# EAGLE design psu1 (EAGLE 9.2.0)
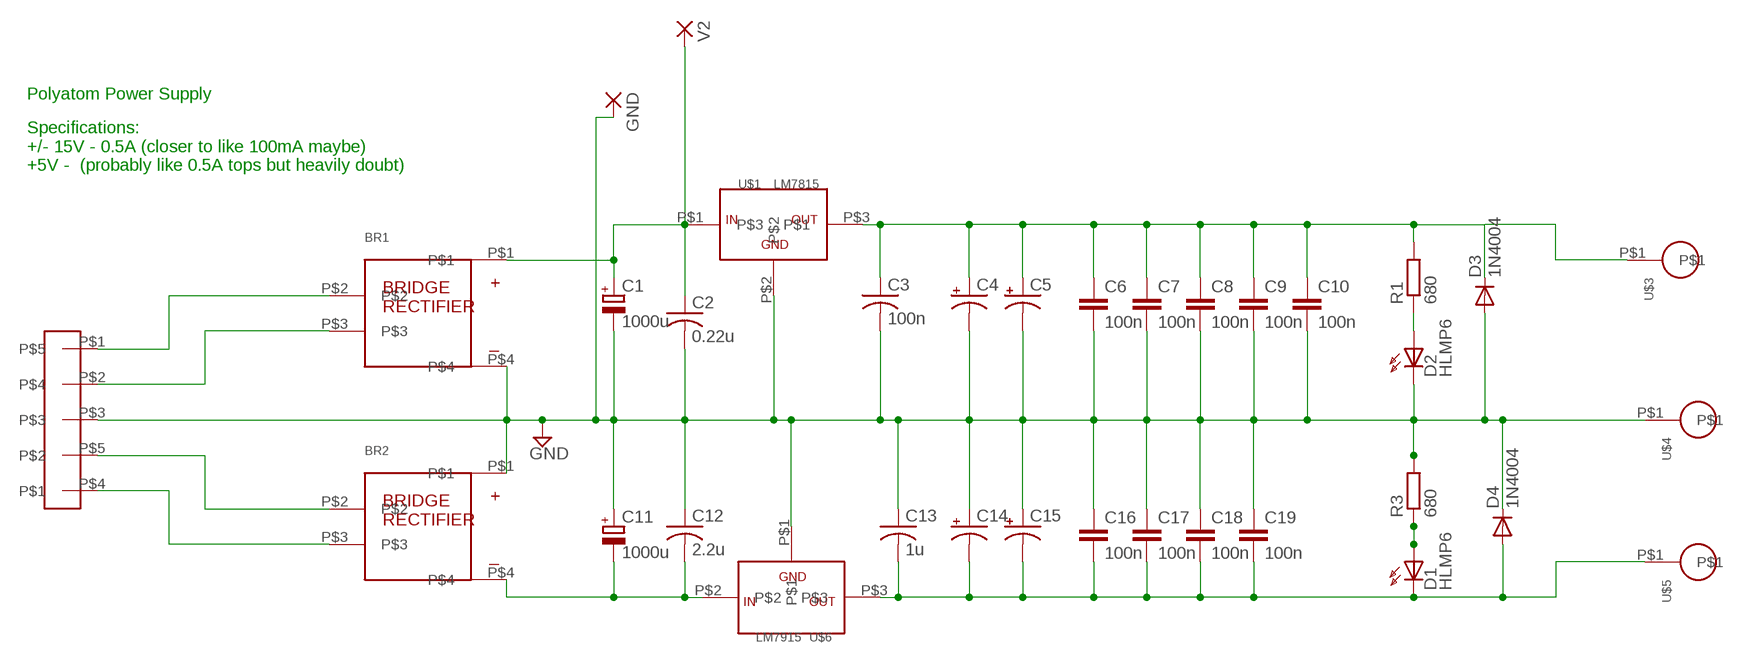
[diagram p0: schematic, sheet 1]

## Parts
BR1  GBU4J  [SIL4]
BR2  GBU4J  [SIL4]
C1  1000u  CPOL-EUE5-13  [E5-13]
C2  0.22u  C-USC1206  [C1206]
C3  100n  C-USC1206  [C1206]
C4  CPOL-USTT2D5  [TT2D5]
C5  CPOL-USTT2D5  [TT2D5]
C6  100n  CC1206  [C1206]
C7  100n  CC1206  [C1206]
C8  100n  CC1206  [C1206]
C9  100n  CC1206  [C1206]
C10  100n  CC1206  [C1206]
C11  1000u  CPOL-EUE5-13  [E5-13]
C12  2.2u  C-USC1206  [C1206]
C13  1u  C-USC1206  [C1206]
C14  CPOL-USTT2D5  [TT2D5]
C15  CPOL-USTT2D5  [TT2D5]
C16  100n  CC1206  [C1206]
C17  100n  CC1206  [C1206]
C18  100n  CC1206  [C1206]
C19  100n  CC1206  [C1206]
D1  HLMP6  [HLMP6]
D2  HLMP6  [HLMP6]
D3  1N4004  [DO41-10]
D4  1N4004  [DO41-10]
GND  3,81/1,1  [3,81/1,1]
R1  680  R0207/10  [0207/10]
R3  680  R0207/10  [0207/10]
U$1  LM7815  [TO-220]
U$3  BANANA  [BANANA]
U$4  BANANA  [BANANA]
U$5  BANANA  [BANANA]
U$6  LM7915  [TO-220]
U$8  TERMINALBLOCK  [TERMINALBLOKC]
V2  3,81/1,1  [3,81/1,1]

## Nets
+15V [POWER]: C3.1 C4.+ C5.+ C6.1 C7.1 C8.1 C9.1 C10.1 D3.C R1.2 U$1.P$3 U$3.P$1
-15V [POWER]: C13.2 C14.- C15.- C16.2 C17.2 C18.2 C19.2 D1.K D4.A U$5.P$1 U$6.P$3
GND [POWER]: BR1.P$4 BR2.P$1 C1.- C2.2 C3.2 C4.- C5.- C6.2 C7.2 C8.2 C9.2 C10.2 C11.+ C12.1 C13.1 C14.+ C15.+ C16.1 C17.1 C18.1 C19.1 D2.K D3.A D4.C GND.1(P) R3.2 U$1.P$2 U$4.P$1 U$6.P$1 U$8.P$3
N$2: D2.A R1.1
N$4: D1.A R3.1
N$8 [POWER]: BR1.P$2 U$8.P$1
N$9 [POWER]: BR1.P$3 U$8.P$2
N$10 [POWER]: BR2.P$2 U$8.P$5
N$11 [POWER]: BR2.P$3 U$8.P$4
NEG [POWER]: BR2.P$4 C11.- C12.2 U$6.P$2
POS: BR1.P$1 C1.+ C2.1 U$1.P$1 V2.1(P)

## Notes on the sheet
- Polyatom Power Supply
- Specifications:
  +/- 15V - 0.5A (closer to like 100mA maybe)
  +5V -  (probably like 0.5A tops but heavily doubt)

## Library data of the parts
BR1 BR2 = STM_Library:GBU4J
C1 C11 = rcl:CPOL-EU: POLARIZED CAPACITOR, European symbol; SPICEPREFIX: C
C2 C3 C12 C13 = rcl:C-US: CAPACITOR, American symbol; SPICEPREFIX: C
C4 C5 C14 C15 = rcl:CPOL-US: POLARIZED CAPACITOR, American symbol; SPICEPREFIX: C
C6-C10 C16-C19 = eagle-ltspice:C: CAPACITOR, European symbol; SPICEMODEL: NONE; SPICEPREFIX: C
D1 D2 = display-hp:HLMP6: LED 2mm horizontal; MF: AGILENT TECHNOLOGIES; MPN: HLMP-6500; OC_FARNELL: 1652490; OC_NEWARK: 40K0088
D3 D4 = diode:1N4004: DIODE general purpose rectifier, 1 A
GND V2 = wirepad:3,81/1,1: THROUGH-HOLE PAD
R1 R3 = eagle-ltspice:R: RESISTOR, European symbol; SPICEMODEL: NONE; SPICEPREFIX: R
U$1 = STM_Library:LM7815
U$3-U$5 = STM_Library:BANANA
U$6 = STM_Library:LM7915
U$8 = STM_Library:TERMINALBLOCK

## Net classes
1 POWER: width 0.762 mm, clearance 0.381 mm

## Board
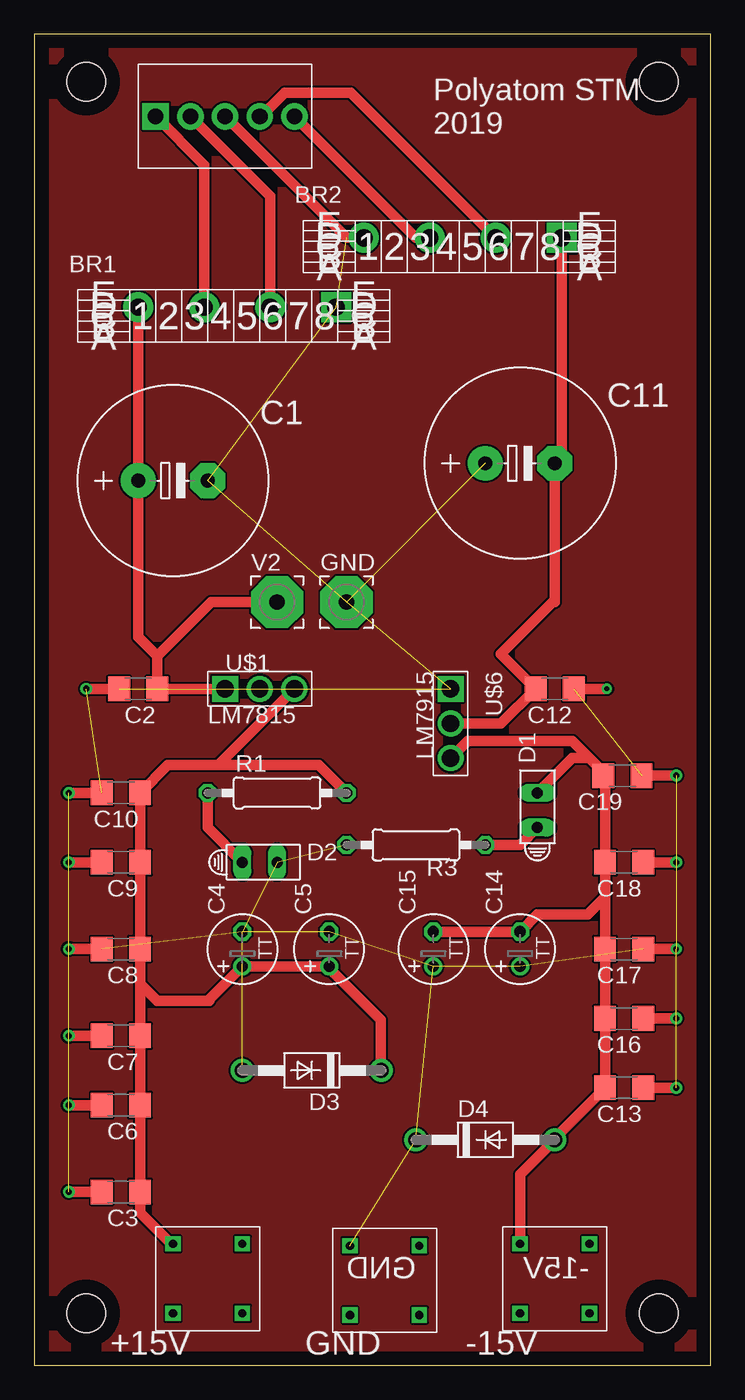
[diagram p1: board, top side]
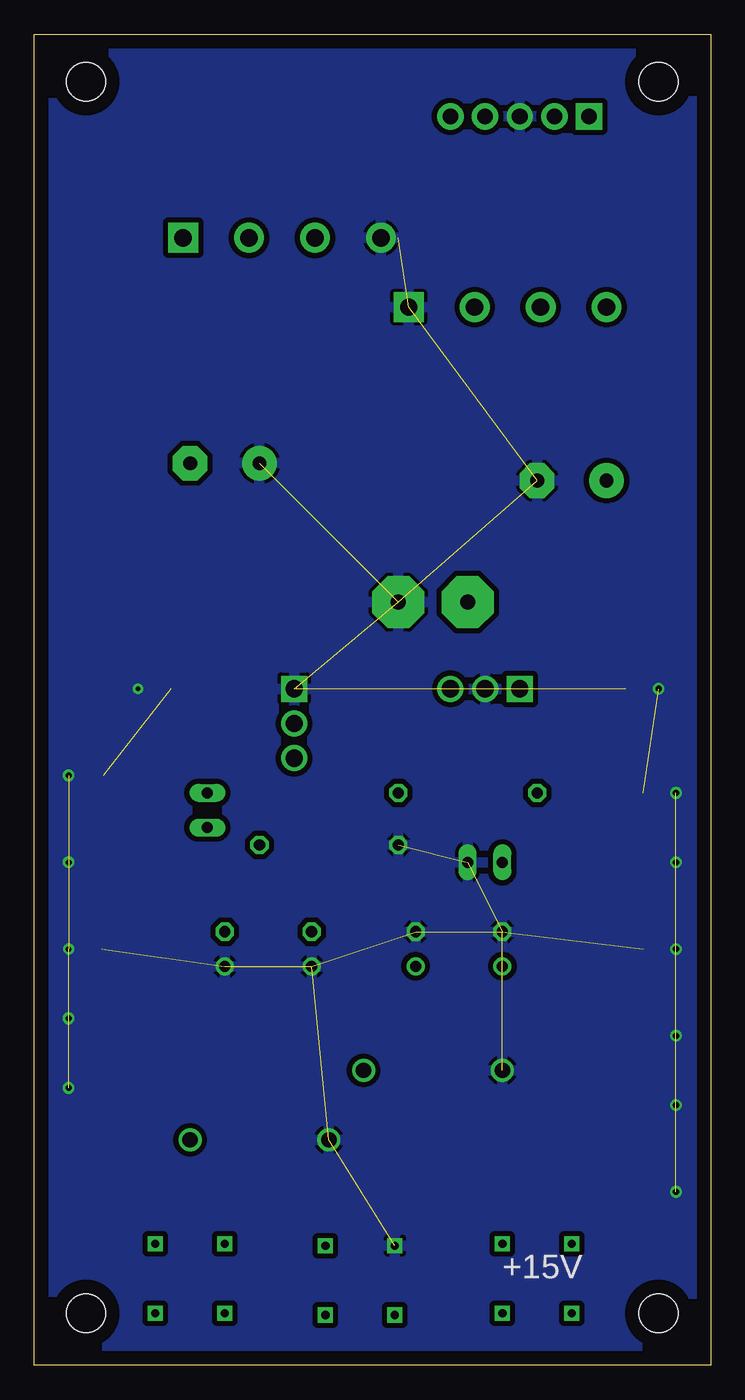
[diagram p2: board, bottom side, seen from below]

Size 49.51 x 97.46 mm. Coordinates in mm from the lower left corner, seen from the top.
Outline: 0,0 49.51,0 49.51,97.46 0,97.46 0,0
Copper layers (1*16): Top 0.035mm / dielectric 1.5mm / Bottom 0.035mm
Design rules "default": minimum track width 6mil, minimum drill 0.35mm, track to track 6mil, track to pad 6mil, pad to pad 6mil, via to via 6mil, smd to smd 6mil, copper to edge 40mil, drill to drill 6mil, minimum pad ring 10mil, minimum via ring 8mil, stop-mask expansion 4mil, vias tented up to drill 0mil, thermal gap 10mil
Holes 2.84 mm at 3.81,3.81 45.72,3.81 45.72,93.98 3.81,93.98

### Footprints (pad centres in the part's own frame; a part is rotated, then mirrored left to right if it is on the bottom)
SIL4 = drill 1.27 pad 2.184: P$1 0,0; P$2 4.826,0; P$3 9.652,0 | drill 1.27 pad 2.184 square: P$4 14.478,0
E5-13 = drill 1.016 pad 2.54: + -2.54,0 | drill 1.016 pad 2.54 octagon: - 2.54,0
C1206 = smd 1.6 x 1.8: 1 -1.4,0; 2 1.4,0
TT2D5 = drill 0.813: + -1.27,0 | drill 0.813 octagon: - 1.27,0
HLMP6 = drill 0.813 long: A -1.27,0; K 1.27,0
DO41-10 = drill 1.118: A 5.08,0; C -5.08,0
3,81/1,1 = drill 1.118 pad 3.81 octagon: 1 0,0
0207/10 = drill 0.813 octagon: 1 -5.08,0; 2 5.08,0
TO-220 = drill 1.27 square: P$1 0,0 | drill 1.27: P$2 2.54,0; P$3 5.08,0
BANANA = drill 0.6 square: P$1 -2.54,2.54; P$2 2.54,2.54; P$3 2.54,-2.54; P$4 -2.54,-2.54
TERMINALBLOKC = drill 1.143 pad 1.93 square: P$1 -3.81,0 | drill 1.143 pad 1.93: P$2 -1.27,0; P$3 1.27,0; P$4 3.81,0; P$5 6.35,0

### Placement (x,y rotation side)
BR1  7.62,77.47 0 top
BR2  24.13,82.55 0 top
C1  10.16,64.77 0 top
C2  7.62,49.53 180 top
C3  6.35,12.7 180 top
C4  15.24,30.48 90 top
C5  21.59,30.48 90 top
C6  6.35,19.05 180 top
C7  6.35,24.13 180 top
C8  6.35,30.48 180 top
C9  6.35,36.83 180 top
C10  6.35,41.91 180 top
C11  35.56,66.04 0 top
C12  38.1,49.53 180 top
C13  43.18,20.32 180 top
C14  35.56,30.48 90 top
C15  29.21,30.48 90 top
C16  43.18,25.4 180 top
C17  43.18,30.48 180 top
C18  43.18,36.83 180 top
C19  43.05,43.18 180 top
D1  36.83,40.64 90 top
D2  16.51,36.83 0 top
D3  20.32,21.59 180 top
D4  33.02,16.51 0 top
GND  22.86,55.88 0 top
R1  17.78,41.91 0 top
R3  27.94,38.1 180 top
U$1  13.97,49.53 0 top
U$3  12.7,6.35 0 top
U$4  25.65,6.22 0 top
U$5  38.1,6.35 0 top
U$6  30.48,49.53 270 top
U$8  12.7,91.44 0 top
V2  17.78,55.88 0 top

### Tracks (layer width: path | path; a pad name or v marks a point on that pad's centre or on a via)
+15V
  Top 0.762: C3.1 7.85,12.8 | 7.85,12.8 7.87,12.83 | C3.1 7.75,12.09 | U$1.P$3 13.47,43.95 | U$3.P$1 10.03,8.89 7.75,11.17 C3.1 | R1.2 20.82,43.95 13.47,43.95 | 13.47,43.95 9.79,43.95 C10.1 C9.1 C8.1 7.75,27.94 | 7.75,27.94 C7.1 C6.1 7.84,19.05 7.75,18.96 | C3.1 7.75,18.96 | 7.75,27.94 9.02,26.67 12.7,26.67 | 12.7,26.67 12.83,26.67 | 7.85,12.8 C3.1 | 7.75,18.96 7.77,19.05 C6.1 | 12.7,26.67 C4.+ C5.+ 21.79,28.88 25.38,25.3 25.38,21.64 D3.C
-15V
  Top 0.762: C19.2 41.78,43.05 | 41.78,43.05 C18.2 41.78,34.29 | 41.78,34.29 C17.2 C16.2 C13.2 38.05,16.59 | 40.64,44.45 39.37,45.72 31.75,45.72 U$6.P$3 | 40.64,44.45 41.78,43.31 41.78,43.05 | D1.K 39.37,44.45 40.64,44.45 | 38.05,16.59 37.97,16.51 | U$5.P$1 35.56,13.97 D4.A 38.1,16.54 38.05,16.59 | C15.- C14.- 36.83,33.02 40.51,33.02 41.78,34.29
GND  (via drill 0.35, 0.4, 0.45)  (28 unrouted)
  Top 0.762: U$8.P$3 22.86,82.55 BR2.P$1 | v3.81,49.53 C2.2 | v2.54,41.91 C10.2 | v2.54,36.83 C9.2 | v2.54,30.48 C8.2 | v2.54,24.13 C7.2 | v2.54,19.05 C6.2 | v2.54,12.7 C3.2 | v46.99,20.32 C13.1 | v46.99,25.4 C16.1 | v46.99,30.48 C17.1 | v46.99,36.83 C18.1 | v46.99,43.18 C19.1 | v41.91,49.53 C12.1
  pour Bottom: 1.27,1.27 48.26,1.27 48.26,96.52 1.27,96.52
N$1
  pour Top: 1.27,96.52 1.27,1.27 48.26,1.27 48.26,96.52
N$2
  Top 0.762: R1.1 12.7,39.37 D2.A
N$4
  Top 0.762: D1.A 35.56,38.1 R3.1
N$8
  Top 0.762: U$8.P$1 12.45,87.88 BR1.P$2
N$9
  Top 0.762: U$8.P$2 17.27,85.6 BR1.P$3
N$10
  Top 0.762: U$8.P$5 27.94,82.55 BR2.P$2
N$11
  Top 0.762: U$8.P$4 16.61,91.44 18.34,93.17 23.16,93.17 BR2.P$3
NEG
  Top 0.762: BR2.P$4 38.61,66.55 C11.- 38.1,55.88 37.97,55.88 34.16,52.07 C12.2 34.16,46.99 U$6.P$2
POS
  Top 0.762: U$1.P$1 C2.1 9.02,51.94 | BR1.P$1 C1.+ 7.62,53.34 9.02,51.94 | 9.02,51.94 12.96,55.88 V2.1

### Text on the board
tNames: Polyatom STM / 2019 | GND | -15V | +15V | GND | -15V
bNames: +15V